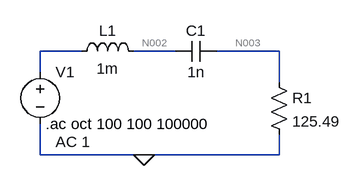
[diagram p0: schematic Draft18.asc]
Draft18.asc, the LTspice schematic file:
Version 4
SHEET 1 880 680
WIRE -32 80 -96 80
WIRE 112 80 48 80
WIRE 272 80 176 80
WIRE -96 112 -96 80
WIRE 272 128 272 80
WIRE -96 240 -96 192
WIRE 64 240 -96 240
WIRE 272 240 272 208
WIRE 272 240 64 240
FLAG 64 240 0
SYMBOL ind -48 96 R270
WINDOW 0 32 56 VTop 2
WINDOW 3 5 56 VBottom 2
SYMATTR InstName L1
SYMATTR Value 1m
SYMBOL res 256 112 R0
SYMATTR InstName R1
SYMATTR Value 125.49
SYMBOL voltage -96 96 R0
WINDOW 123 24 124 Left 2
WINDOW 39 0 0 Left 2
SYMATTR InstName V1
SYMATTR Value ""
SYMATTR Value2 AC 1
SYMBOL cap 176 64 R90
WINDOW 0 0 32 VBottom 2
WINDOW 3 32 32 VTop 2
SYMATTR InstName C1
SYMATTR Value 1n
TEXT -88 192 Left 2 !.ac oct 100 100 100000

The netlist it stands for:
* Draft18.asc
L1 N001 N002 1m
R1 N003 0 125.49
V1 N001 0 AC 1
C1 N003 N002 1n
.ac oct 100 100 100000
.backanno
.end

* Results of the author's LTspice run, read from the files saved beside the schematic
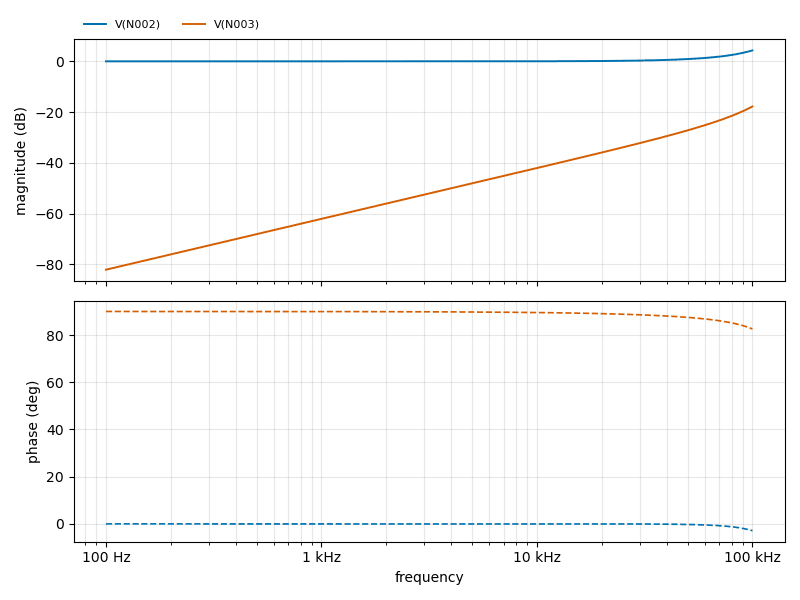
[diagram p1: AC Analysis of Draft18.asc, plotted from the saved traces]
* AC Analysis, 1 run:
*   V(N002): 0.00 dB at 100 Hz, 4.32 dB at 100 kHz, peak 4.32 dB at 100 kHz, 3 dB below the peak at 59.52 kHz
*   V(N003): -82.06 dB at 100 Hz, -17.78 dB at 100 kHz, peak -17.78 dB at 100 kHz, 3 dB below the peak at 83.96 kHz